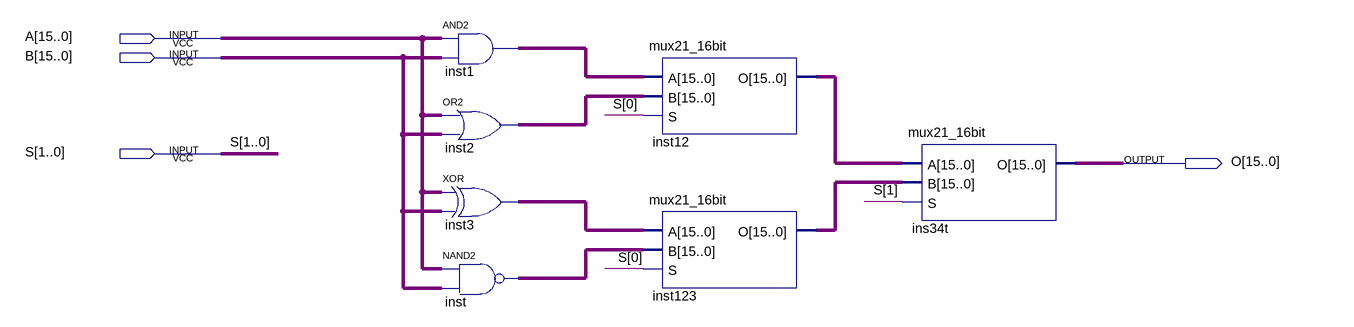
[diagram p0: schematic sheet]
// Quartus schematic khoiChucNang.bdf as structural Verilog: 7 symbols, 4 pins
module khoiChucNang (
  input  [15:0] A,
  input  [15:0] B,
  input  [1:0] S,
  output [15:0] O
);

  wire [15:0] inst1_out, inst2_out, inst3_out, inst12_o, inst123_o, inst_out;

  assign inst1_out = A & B;  // AND2 inst1, 16 bits wide
  assign inst2_out = A | B;  // OR2 inst2, 16 bits wide
  assign inst3_out = A ^ B;  // XOR inst3, 16 bits wide
  assign inst_out = ~(A & B);  // NAND2 inst, 16 bits wide
  mux21_16bit inst12 (.A(inst1_out), .B(inst2_out), .S(S[0]), .O(inst12_o));
  mux21_16bit inst123 (.A(inst3_out), .B(inst_out), .S(S[0]), .O(inst123_o));
  mux21_16bit ins34t (.A(inst12_o), .B(inst123_o), .S(S[1]), .O(O));
endmodule
